# EAGLE design shifty (EAGLE 7.2.0)
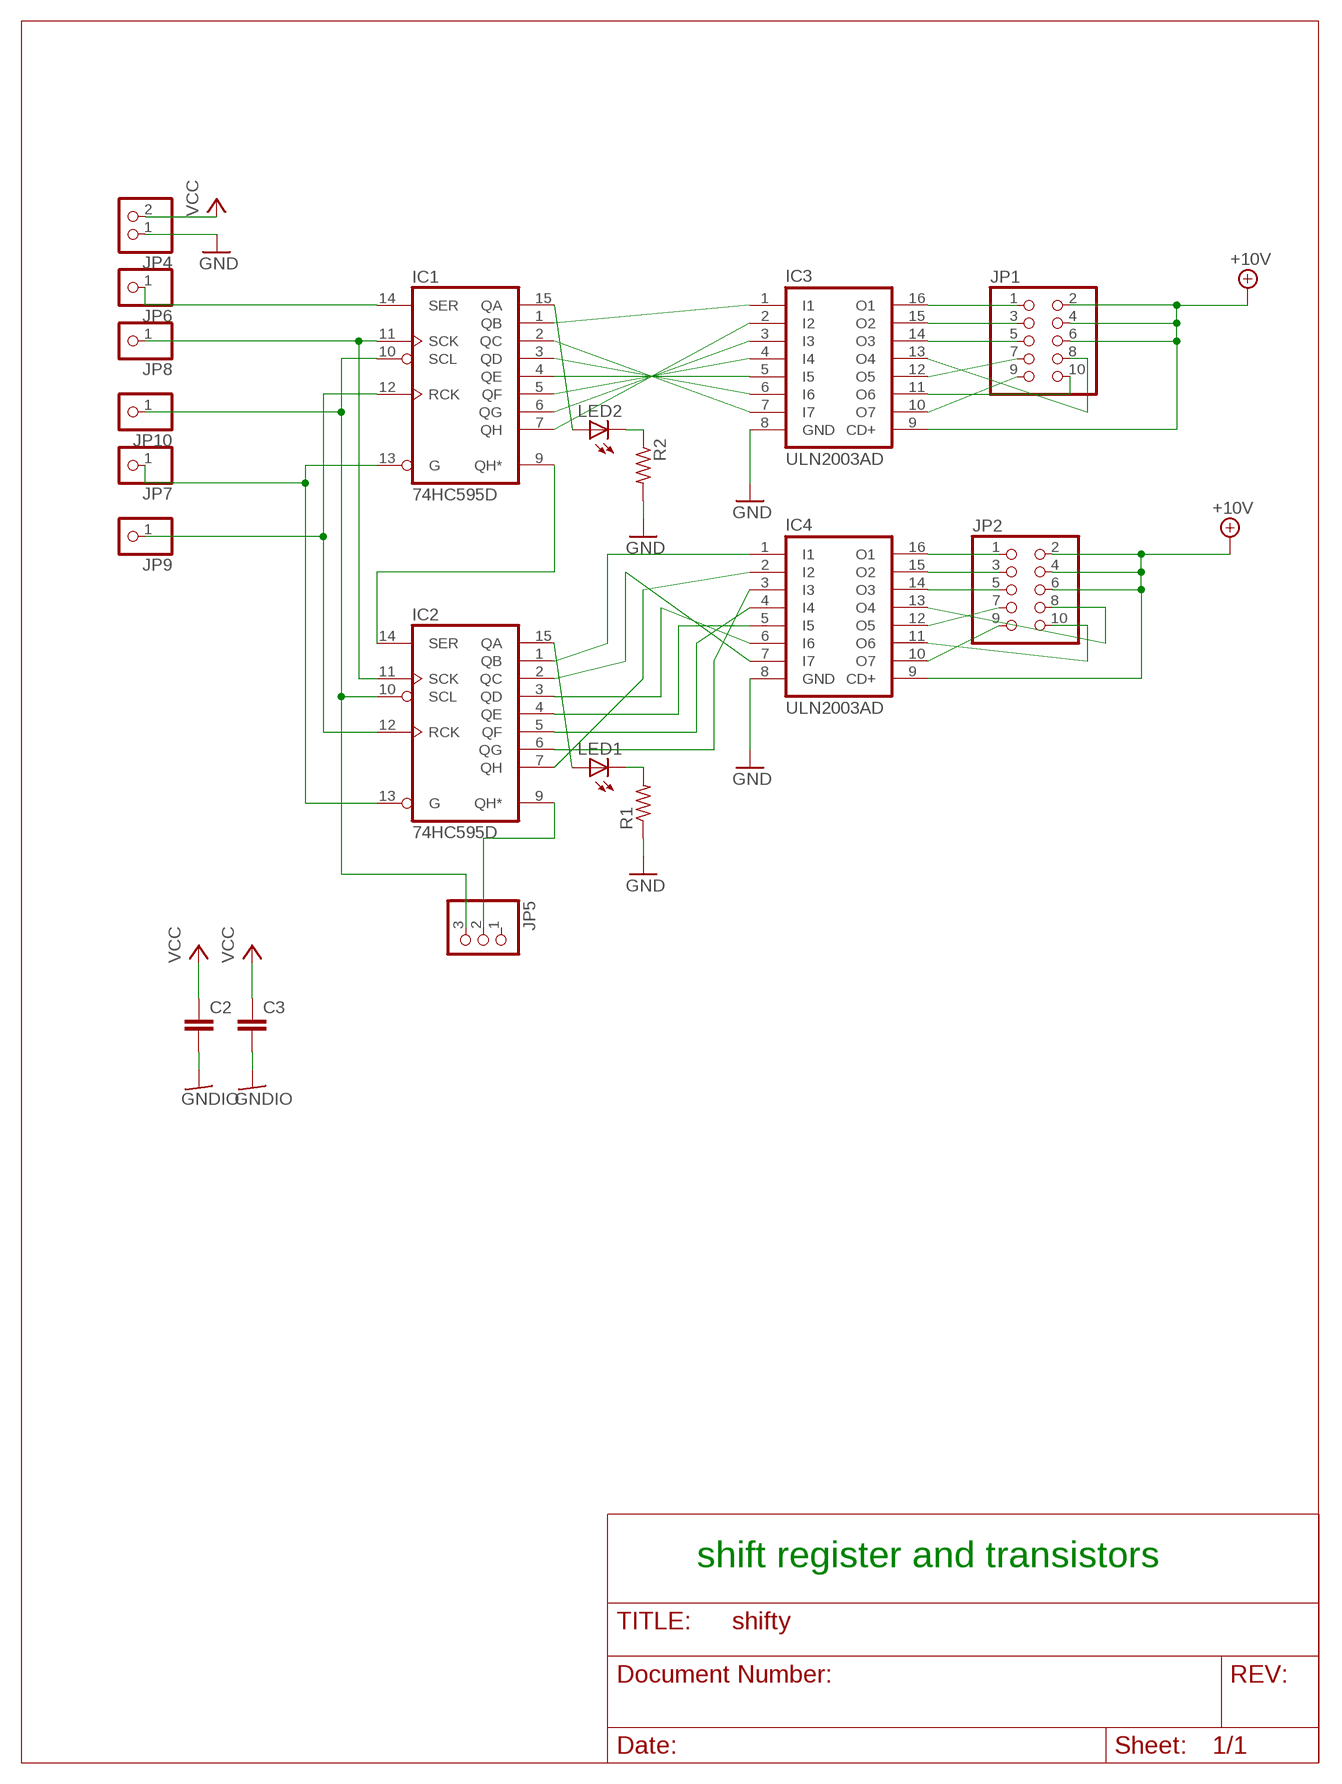
[diagram p0: schematic, sheet 1]

## Parts
C2  C-EUC0805  [C0805]
C3  C-EUC0805  [C0805]
IC1  74HC595D  [SO16]
IC2  74HC595D  [SO16]
IC3  ULN2003AD  [SO16]
IC4  ULN2003AD  [SO16]
JP1  PINHD-2X5  [2X05]
JP2  PINHD-2X5  [2X05]
JP4  PINHD-1X2  [1X02]
JP5  PINHD-1X3  [1X03]
JP6  PINHD-1X1  [1X01]
JP7  PINHD-1X1  [1X01]
JP8  PINHD-1X1  [1X01]
JP9  PINHD-1X1  [1X01]
JP10  PINHD-1X1  [1X01]
LED1  LEDCHIP-LED0603  [CHIP-LED0603]
LED2  LEDCHIP-LED0603  [CHIP-LED0603]
R1  R-US_R0603  [R0603]
R2  R-US_R0603  [R0603]

## Nets
+10V: IC3.9(CD+) IC4.9(CD+) JP1.2 JP1.4 JP1.6 JP2.2 JP2.4 JP2.6
GND: IC3.8(GND) IC4.8(GND) JP4.1 R1.1 R2.2
GNDIO [signal]: C2.2 C3.2
N$1 [signal]: IC1.1(QB) IC3.1(I1)
N$2 [signal]: IC1.7(QH) IC3.2(I2)
N$3 [signal]: IC1.2(QC) IC3.7(I7)
N$4 [signal]: IC1.3(QD) IC3.6(I6)
N$5 [signal]: IC1.4(QE) IC3.5(I5)
N$6 [signal]: IC1.5(QF) IC3.4(I4)
N$7 [signal]: IC1.6(QG) IC3.3(I3)
N$8 [signal]: IC1.11(SCK) IC2.11(SCK) JP8.1
N$9 [signal]: IC2.1(QB) IC4.1(I1)
N$10 [signal]: IC2.2(QC) IC4.7(I7)
N$11 [signal]: IC2.7(QH) IC4.2(I2)
N$12 [signal]: IC2.3(QD) IC4.6(I6)
N$13: IC2.4(QE) IC4.5(I5)
N$14 [signal]: IC2.5(QF) IC4.4(I4)
N$15 [signal]: IC2.6(QG) IC4.3(I3)
N$16: IC1.14(SER) JP6.1
N$17 [signal]: IC2.15(QA) LED1.A
N$18 [signal]: IC1.10(SCL) IC2.10(SCL) JP5.3 JP10.1
N$19 [signal]: IC1.9(QH*) IC2.14(SER)
N$20 [signal]: IC1.12(RCK) IC2.12(RCK) JP9.1
N$21: IC3.16(O1) JP1.1
N$22: IC3.15(O2) JP1.3
N$23: IC3.14(O3) JP1.5
N$24: IC3.12(O5) JP1.7
N$25: IC3.10(O7) JP1.9
N$26: IC3.11(O6) JP1.10
N$27: IC3.13(O4) JP1.8
N$28 [signal]: LED1.C R1.2
N$29: IC2.9(QH*) JP5.2
N$30: IC4.16(O1) JP2.1
N$31: IC4.15(O2) JP2.3
N$32: IC4.14(O3) JP2.5
N$33: IC4.12(O5) JP2.7
N$34: IC4.10(O7) JP2.9
N$35: IC4.13(O4) JP2.8
N$36: IC4.11(O6) JP2.10
N$37 [signal]: LED2.C R2.1
N$38 [signal]: IC1.15(QA) LED2.A
N$43 [signal]: IC1.13(G) IC2.13(G) JP7.1
VCC: C2.1 C3.1 JP4.2
Unconnected: JP5.1

## Notes on the sheet
- shift register and transistors

## Power pins joined to a net without a drawn wire
GND: IC1.8(GND) IC2.8(GND)
VCC: IC1.16(VCC) IC2.16(VCC)

## Library data of the parts
C2 C3 = rcl:C-EU: CAPACITOR, European symbol
IC1 IC2 = 74xx-eu:74*595: 8-bit SHIFT REGISTER, output latch
IC3 IC4 = uln-udn:ULN2003A: DRIVER ARRAY
JP1 JP2 = pinhead:PINHD-2X5: PIN HEADER
JP4 = pinhead:PINHD-1X2: PIN HEADER
JP5 = pinhead:PINHD-1X3: PIN HEADER
JP6-JP10 = adafruit:PINHD-1X1: Pin header 1x1 for 0.1" spacing With round pins
LED1 LED2 = adafruit:LED: LED OSRAM: - CHIPLED LG R971, LG N971, LY N971, LG Q971, LY Q971, LO R971, LY R971 LH N974, LH R974 LS Q976, LO Q976, LY Q976 LO Q996 - Hyper CHIPLED LW Q18S LB Q993, LB Q99A, LB R99A - SideLED LS A670, LO A670, LY A670, LG A670, LP A670 LB A673, LV A673, LT A673, LW A673 LH A674 LY A675 LS A676, LA A676, LO A676, LY A676, LW A676 LS A679, LY A679, LG A679 - Hyper Micro SIDELED® LS Y876, LA Y876, LO Y876, LY Y876 LT Y87S - SmartLED LW L88C, LW L88S LB L89C, LB L89S, LG L890 LS L89K, LO L89K, LY L89K LS L896, LA L896, LO L896, LY L896 - TOPLED LS T670, LO T670, LY T670, LG T670, LP T670 LSG T670, LSP T670, LSY T670, LOP T670, LYG T670 LG T671, LOG T671, LSG T671 LB T673, LV T673, LT T673, LW T673 LH T674 LS T676, LA T676, LO T676, LY T676, LB T676, LH T676, LSB T676, LW T676 LB T67C, LV T67C, LT T67C, LS T67K, LO T67K, LY T67K, LW E67C LS E67B, LA E67B, LO E67B, LY E67B, LB E67C, LV E67C, LT E67C LW T67C LS T679, LY T679, LG T679 LS T770, LO T770, LY T770, LG T770, LP T770 LB T773, LV T773, LT T773, LW T773 LH T774 LS E675, LA E675, LY E675, LS T675 LS T776, LA T776, LO T776, LY T776, LB T776 LHGB T686 LT T68C, LB T68C - Hyper Mini TOPLED® LB M676 - Mini TOPLED Santana® LG M470 LS M47K, LO M47K, LY M47K Source: http://www.osram.convergy.de/
R1 R2 = adafruit:R-US_: RESISTOR, American symbol

## Net classes
0 supply: width 0.508 mm
1 signal: width 0.254 mm

## Board
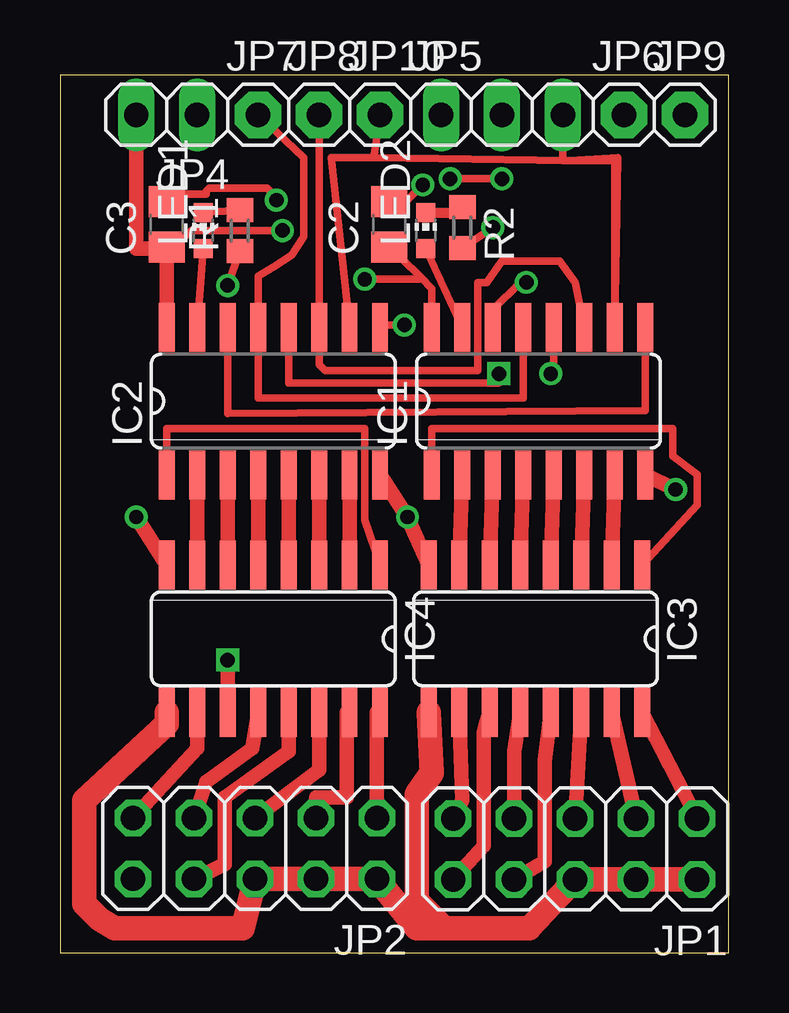
[diagram p1: board, top side]
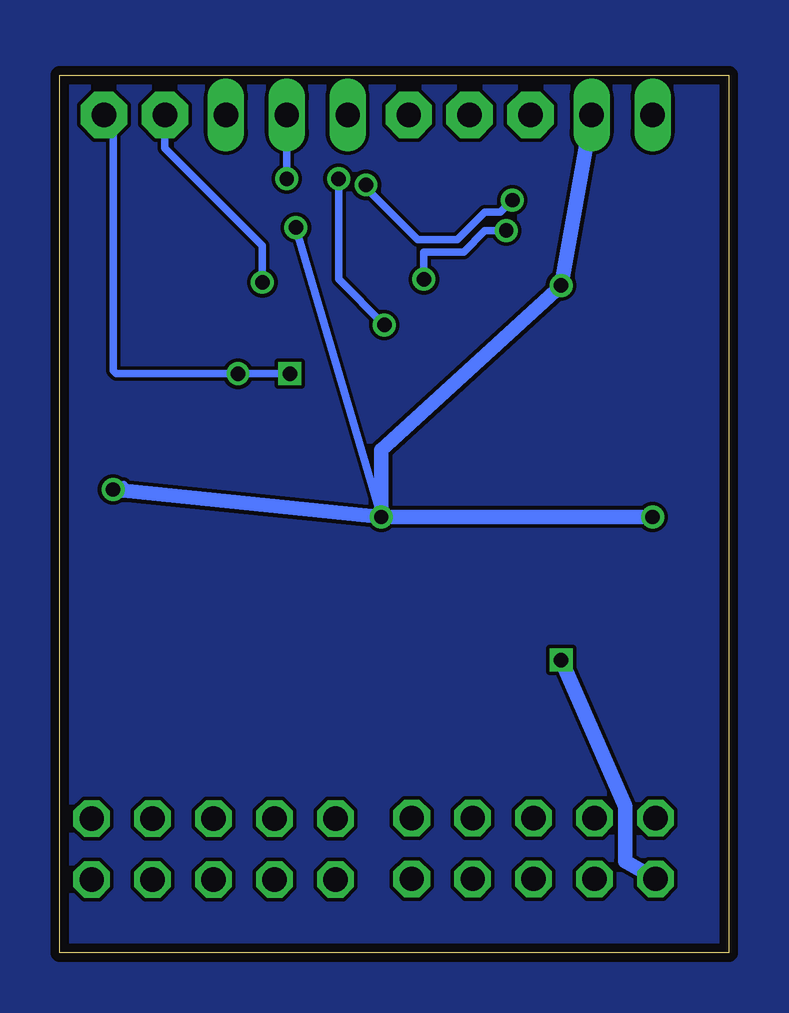
[diagram p2: board, bottom side, seen from below]

Size 27.86 x 36.57 mm. Coordinates in mm from the lower left corner, seen from the top.
Outline: 0,0 27.86,0 27.86,36.57 0,36.57 0,0
Copper layers (1*16): Top 0.0356mm / dielectric 1.5011mm / Bottom 0.0356mm
Design rules "LaenPCBOrder": minimum track width 6mil, minimum drill 13mil, track to track 6mil, track to pad 6mil, pad to pad 6mil, via to via 6mil, smd to smd 6mil, copper to edge 15mil, drill to drill 6mil, minimum pad ring 7mil, minimum via ring 7mil, stop-mask expansion 3mil, vias tented up to drill 0mil, thermal gap 10mil

### Footprints (pad centres in the part's own frame; a part is rotated, then mirrored left to right if it is on the bottom)
C0805 = smd 1.3 x 1.5: 1 -0.95,0; 2 0.95,0
SO16 = smd 0.66 x 2.032: 1 -4.445,-3.073; 2 -3.175,-3.073; 3 -1.905,-3.073; 4 -0.635,-3.073; 5 0.635,-3.073; 6 1.905,-3.073; 7 3.175,-3.073; 8 4.445,-3.073; 9 4.445,3.073; 10 3.175,3.073; 11 1.905,3.073; 12 0.635,3.073; 13 -0.635,3.073; 14 -1.905,3.073; 15 -3.175,3.073; 16 -4.445,3.073
2X05 = drill 1.016 octagon: 1 -5.08,-1.27; 2 -5.08,1.27; 3 -2.54,-1.27; 4 -2.54,1.27; 5 0,-1.27; 6 0,1.27; 7 2.54,-1.27; 8 2.54,1.27; 9 5.08,-1.27; 10 5.08,1.27
1X02 = drill 1.016 long: 1 -1.27,0; 2 1.27,0
1X03 = drill 1.016 long: 1 -2.54,0; 2 0,0; 3 2.54,0
1X01 = drill 1.016 pad 1.93 octagon: 1 0,0
CHIP-LED0603 = smd 0.8 x 0.8: A 0,-0.75; C 0,0.75
R0603 = smd 1 x 1.1: 1 -0.85,0; 2 0.85,0

### Placement (x,y rotation side)
C2  13.72,30.35 90 top
C3  4.45,30.35 90 top
IC1  19.94,22.99 0 top
IC2  8.89,22.99 0 top
IC3  19.81,13.08 180 top
IC4  8.89,13.08 180 top
JP1  21.46,4.32 180 top
JP2  8.13,4.34 180 top
JP4  4.45,34.93 180 top
JP5  18.41,34.93 0 top
JP6  23.5,34.93 0 top
JP7  8.26,34.93 0 top
JP8  10.79,34.93 0 top
JP9  26.04,34.93 0 top
JP10  13.34,34.93 0 top
LED1  5.97,30.1 0 top
LED2  15.24,30.1 0 top
R1  7.49,30.1 90 top
R2  16.76,30.23 270 top

### Tracks (layer width: path | path; a pad name or v marks a point on that pad's centre or on a via)
+10V
  Top 1.016: IC4.9 4.45,9.52 1.02,6.35 1.02,2.03 1.65,1.4 2.29,1.02 7.62,1.02 JP2.6 JP2.4 JP2.2 14.86,1.02 16,1.02 | 16,1.02 19.56,1.02 JP1.6 JP1.4 JP1.2 | IC3.9 15.49,7.49 14.86,6.6 14.86,2.16 16,1.02
GND  (via drill 0.6)
  Top 0.305: R2.2 v18.03,30.23 | R1.1 v6.99,27.81
  Top 0.61: IC2.8 v14.48,18.16 IC3.8 | IC4.8 v3.18,18.16 | IC1.8 v25.65,19.3
  Bottom 0.305: 25.2,19.52 v25.65,19.3 | v18.03,30.23 v14.48,18.16
  Bottom 0.61: v25.65,19.3 v14.48,18.16 | v3.18,18.16 v14.48,18.16 | JP4.1 v6.99,27.81 14.48,20.95 v14.48,18.16
GNDIO  (via drill 0.6)
  Top 0.305: C3.2 4.95,31.62 6.1,31.62 6.1,31.75 6.22,31.88 8.64,31.88 9.02,31.5 v9.02,31.37 | v15.11,32 14.35,31.24 13.72,31.24 C2.2
  Bottom 0.305: 9.02,31.24 v9.02,31.37 9.53,30.86 10.16,30.86 11.3,29.72 12.95,29.72 15.18,31.94 | 15.18,31.94 15.37,32.13 | v15.11,32 15.18,31.94
N$1
  Top 0.305: IC1.1 15.49,21.84 25.53,21.84 25.53,20.7 26.54,19.94 26.54,18.67 IC3.1
N$2
  Top 0.61: IC1.7 IC3.2
N$3
  Top 0.61: IC1.2 IC3.7
N$4
  Top 0.61: IC1.3 IC3.6
N$5
  Top 0.61: IC1.4 IC3.5
N$6
  Top 0.61: IC1.5 IC3.4
N$7
  Top 0.61: IC1.6 IC3.3
N$8
  Top 0.305: JP8.1 IC2.11 10.79,24.51 11.05,24.26 17.4,24.26 17.4,27.94 17.78,27.94 18.41,28.83 20.83,28.83 21.46,27.94 IC1.11
N$9
  Top 0.305: IC2.1 4.45,21.84 12.7,21.84 12.7,18.03 IC4.1
N$10
  Top 0.61: IC2.2 IC4.7
N$11
  Top 0.61: IC2.7 IC4.2
N$12
  Top 0.61: IC2.3 IC4.6
N$13
  Top 0.61: IC2.4 IC4.5
N$14
  Top 0.61: IC2.5 IC4.4
N$15
  Top 0.61: IC2.6 IC4.3
N$16  (via drill 0.6)
  Top 0.305: v19.43,27.94 19.18,27.94 18.03,26.8 IC1.14
  Bottom 0.305: JP6.1 23.5,33.53 19.43,29.46 v19.43,27.94
N$17
  Top 0.305: IC2.15 LED1.A
N$18
  Top 0.305: IC2.10 11.3,33.15 13.07,33.14 | 13.07,33.14 21.21,33.02 23.24,33.15 IC1.10 23.11,33.02 20.96,33.02 JP5.3 | JP10.1 13.07,33.14
N$19
  Top 0.305: IC2.14 6.99,22.48 24.38,22.61 IC1.9
N$20  (via drill 0.6)
  Top 0.305: IC2.12 9.53,23.75 18.29,23.75 v18.29,24.13 | IC1.12 20.57,24.26 v20.45,24.13
  Bottom 0.305: v18.29,24.13 v20.45,24.13 20.96,24.13 25.53,24.13 25.65,24.26 25.65,34.54 JP9.1
N$21
  Top 0.61: IC3.16 JP1.1
N$22
  Top 0.61: IC3.15 JP1.3
N$23
  Top 0.61: IC3.14 JP1.5
N$24
  Top 0.61: IC3.12 18.92,8.38 JP1.7
N$25
  Top 0.61: IC3.10 16.76,6.35 JP1.9
N$26
  Top 0.61: IC3.11 17.78,9.65 17.65,9.14 17.65,4.45 JP1.10
N$27
  Top 0.61: IC3.13 20.19,8 20.19,3.81 JP1.8
N$28
  Top 0.305: LED1.C R1.2
N$29  (via drill 0.6)
  Top 0.305: v14.35,26.16 13.34,26.16 IC2.9 | v18.41,32.26 v16.26,32.26
  Bottom 0.305: v14.35,26.16 16.26,28.07 v16.26,32.26 | JP5.2 v18.41,32.26
N$30
  Top 0.61: IC4.16 13.21,10.01 JP2.1
N$31
  Top 0.61: IC4.15 11.94,10.01 11.94,6.48 10.67,6.48 JP2.3
N$32
  Top 0.61: IC4.14 10.79,7.62 JP2.5
N$33
  Top 0.61: IC4.12 8,8.51 6.1,7.11 JP2.7
N$34
  Top 0.61: IC4.10 5.71,8.51 JP2.9
N$35
  Top 0.61: IC4.13 9.53,8.38 6.86,6.48 6.86,3.68 JP2.8
N$36  (via drill 0.6)
  Top 0.61: IC4.11 v6.99,12.19
  Bottom 0.61: v6.99,12.19 4.32,6.1 4.32,3.81 JP2.10
N$37
  Top 0.406: LED2.C 16.76,30.85 R2.1
N$38
  Top 0.305: IC1.15 LED2.A
N$39
  pour Bottom (no thermals): -3.3,47.68 -3.3,-3.17 34.84,-3.17 34.84,47.68
N$43
  Top 0.305: IC1.13 19.3,23.11 8.26,23.11 IC2.13 8.26,28.19 8.89,28.57 9.65,29.08 10.16,29.85 10.16,33.15 JP7.1
VCC  (via drill 0.6)
  Top 0.305: IC1.16 15.49,27.69 15.05,28.13 | 15.05,28.13 14.22,28.96 14.22,29.46 13.72,29.46 C2.1 | v9.27,30.1 5.46,30.1 5.21,29.85 4.83,29.85 4.57,29.59 C3.1 | v12.7,28.07 14.99,28.07 15.05,28.13
  Top 0.61: IC2.16 C3.1 4.45,29.34 3.18,29.34 JP4.2
  Bottom 0.305: v9.27,30.1 10.16,30.1 11.05,29.21 12.7,29.21 v12.7,28.07